# EAGLE schematic PCB_Motor_Robot (EAGLE 7.5.0)
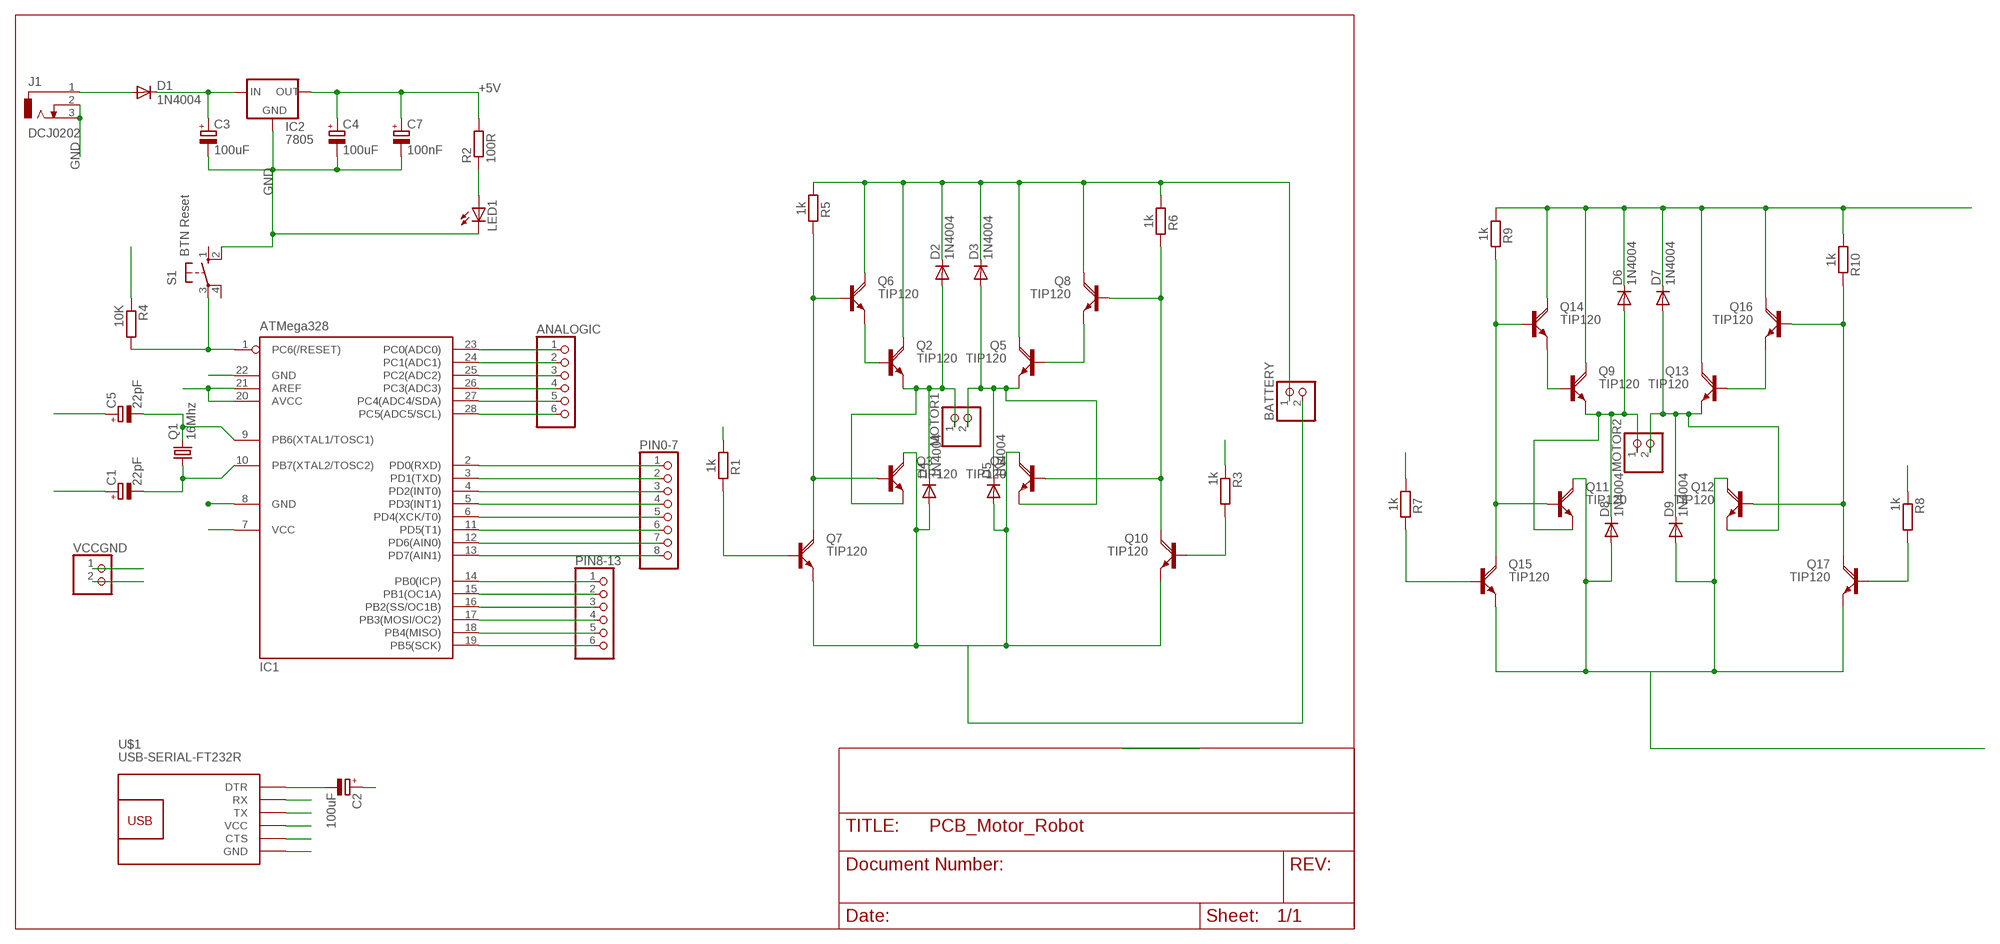
[diagram p0: schematic, sheet 1]

## Parts
ANALOGIC  PINHD-1X6  [1X06]
BATTERY  PINHD-1X2  [1X02]
C1  22pF  CPOL-EUE2.5-5  [E2,5-5]
C2  100uF  CPOL-EUTAP5-50  [TAP5-50]
C3  100uF  CPOL-EUTAP5-50  [TAP5-50]
C4  100uF  CPOL-EUTAP5-50  [TAP5-50]
C5  22pF  CPOL-EUE2.5-5  [E2,5-5]
C7  100nF  CPOL-EUE2.5-5  [E2,5-5]
D1  1N4004  [DO41-10]
D2  1N4004  [DO41-10]
D3  1N4004  [DO41-10]
D4  1N4004  [DO41-10]
D5  1N4004  [DO41-10]
D6  1N4004  [DO41-10]
D7  1N4004  [DO41-10]
D8  1N4004  [DO41-10]
D9  1N4004  [DO41-10]
IC1  ATMega328  MEGA8-P  [DIL28-3]
IC2  7805  78XXL  [78XXL]
J1  DCJ0202  [DCJ0202]
LED1  LED5MM  [LED5MM]
MOTOR1  PINHD-1X2  [1X02]
MOTOR2  PINHD-1X2  [1X02]
PIN0-7  PINHD-1X8  [1X08]
PIN8-13  PINHD-1X6  [1X06]
Q1  16Mhz  CRYSTALHC49S  [HC49/S]
Q2  TIP120  [TO220AH]
Q3  TIP120  [TO220AH]
Q4  TIP120  [TO220AH]
Q5  TIP120  [TO220AH]
Q6  TIP120  [TO220AH]
Q7  TIP120  [TO220AH]
Q8  TIP120  [TO220AH]
Q9  TIP120  [TO220AH]
Q10  TIP120  [TO220AH]
Q11  TIP120  [TO220AH]
Q12  TIP120  [TO220AH]
Q13  TIP120  [TO220AH]
Q14  TIP120  [TO220AH]
Q15  TIP120  [TO220AH]
Q16  TIP120  [TO220AH]
Q17  TIP120  [TO220AH]
R1  1k  R-EU_0204/7  [0204/7]
R2  100R  R-EU_0204/7  [0204/7]
R3  1k  R-EU_0204/7  [0204/7]
R4  10K  R-EU_0204/7  [0204/7]
R5  1k  R-EU_0204/7  [0204/7]
R6  1k  R-EU_0204/7  [0204/7]
R7  1k  R-EU_0204/7  [0204/7]
R8  1k  R-EU_0204/7  [0204/7]
R9  1k  R-EU_0204/7  [0204/7]
R10  1k  R-EU_0204/7  [0204/7]
S1  BTN Reset  10-XX  [B3F-10XX]
U$1  USB-SERIAL-FT232R  [USB-SERIAL-FT232R]
VCCGND  PINHD-1X2  [1X02]

## Nets
+5V: C4.+ C7.+ IC1.7(VCC) IC1.20(AVCC) IC1.21(AREF) IC2.OUT R2.2 R4.1 U$1.4(VCC) VCCGND.1
DTR: C2.- U$1.1(DTR)
GND: BATTERY.2 C1.+ C3.- C4.- C5.+ C7.- D4.A D5.A D8.A D9.A IC1.8(GND) IC1.22(GND) IC2.GND J1.2 J1.3 LED1.K(C) Q3.C Q4.C Q7.E Q10.E Q11.C Q12.C Q15.E Q17.E S1.2(S1) U$1.6(GND) VCCGND.2
M1-A1: IC1.17(PB3(MOSI/OC2)) PIN8-13.4 R3.1
M1-B1: IC1.16(PB2(SS/OC1B)) PIN8-13.3 R1.1
M2-A1: IC1.12(PD6(AIN0)) PIN0-7.7 R8.1
M2-B1: IC1.11(PD5(T1)) PIN0-7.6 R7.1
N$1: C5.- IC1.9(PB6(XTAL1/TOSC1)) Q1.2
N$2: C1.- IC1.10(PB7(XTAL2/TOSC2)) Q1.1
N$3: Q5.B Q8.E
N$4: Q10.B R3.2
N$5: D1.A J1.1
N$6: C3.+ D1.C IC2.IN
N$7: Q7.B R1.2
N$8: Q2.B Q6.E
N$9: Q9.B Q14.E
N$10: Q3.B Q6.B Q7.C R5.2
N$11: Q4.B Q8.B Q10.C R6.2
N$12: Q13.B Q16.E
N$14: D2.A D4.C MOTOR1.1 Q2.E Q3.E
N$15: D3.A D5.C MOTOR1.2 Q4.E Q5.E
N$17: Q17.B R8.2
N$19: Q15.B R7.2
N$20: ANALOGIC.1 IC1.23(PC0(ADC0))
N$21: ANALOGIC.2 IC1.24(PC1(ADC1))
N$22: ANALOGIC.3 IC1.25(PC2(ADC2))
N$23: ANALOGIC.4 IC1.26(PC3(ADC3))
N$24: ANALOGIC.5 IC1.27(PC4(ADC4/SDA))
N$25: ANALOGIC.6 IC1.28(PC5(ADC5/SCL))
N$28: IC1.4(PD2(INT0)) PIN0-7.3
N$29: IC1.5(PD3(INT1)) PIN0-7.4
N$30: IC1.6(PD4(XCK/T0)) PIN0-7.5
N$31: IC1.13(PD7(AIN1)) PIN0-7.8
N$32: IC1.14(PB0(ICP)) PIN8-13.1
N$33: IC1.15(PB1(OC1A)) PIN8-13.2
N$34: IC1.18(PB4(MISO)) PIN8-13.5
N$35: IC1.19(PB5(SCK)) PIN8-13.6
N$36: Q11.B Q14.B Q15.C R9.2
N$37: Q12.B Q16.B Q17.C R10.2
N$40: U$1.5(CTS)
N$41: D6.A D8.C MOTOR2.1 Q9.E Q11.E
N$42: D7.A D9.C MOTOR2.2 Q12.E Q13.E
N$48: LED1.A R2.1
RESET: C2.+ IC1.1(PC6(/RESET)) R4.2 S1.3(P)
RX: IC1.2(PD0(RXD)) PIN0-7.1 U$1.3(TX)
TX: IC1.3(PD1(TXD)) PIN0-7.2 U$1.2(RX)
VCC-BAT: BATTERY.1 D2.C D3.C D6.C D7.C Q2.C Q5.C Q6.C Q8.C Q9.C Q13.C Q14.C Q16.C R5.1 R6.1 R9.1 R10.1
Unconnected: S1.1(S) S1.4(P1)

## Library data of the parts
ANALOGIC PIN8-13 = pinhead:PINHD-1X6: PIN HEADER
BATTERY MOTOR1 MOTOR2 VCCGND = pinhead:PINHD-1X2: PIN HEADER
C1-C5 C7 = rcl:CPOL-EU: POLARIZED CAPACITOR, European symbol
D1-D9 = diode:1N4004: DIODE general purpose rectifier, 1 A
IC1 = atmel:MEGA8-P: MICROCONTROLLER 8 Kbytes FLASH, 1 kbytes SRAM, 512 bytes EEPROM, USART, 4-channel 10 bit ADC, 2-channel 8 bit ADC Pin compatible with Atmega48, ATMega88, ATMega168 Source: avr.lbr; OC_FARNELL: unknown; OC_NEWARK: unknown
IC2 = v-reg:78XXL: VOLTAGE REGULATOR
J1 = con-jack:DCJ0202: DC POWER JACK Source: DCJ0202.pdf; OC_FARNELL: unknown; OC_NEWARK: unknown
LED1 = led:LED: LED OSRAM: - CHIPLED LG R971, LG N971, LY N971, LG Q971, LY Q971, LO R971, LY R971 LH N974, LH R974 LS Q976, LO Q976, LY Q976 LO Q996 - Hyper CHIPLED LW Q18S LB Q993, LB Q99A, LB R99A - SideLED LS A670, LO A670, LY A670, LG A670, LP A670 LB A673, LV A673, LT A673, LW A673 LH A674 LY A675 LS A676, LA A676, LO A676, LY A676, LW A676 LS A679, LY A679, LG A679 - Hyper Micro SIDELED® LS Y876, LA Y876, LO Y876, LY Y876 LT Y87S - SmartLED LW L88C, LW L88S LB L89C, LB L89S, LG L890 LS L89K, LO L89K, LY L89K LS L896, LA L896, LO L896, LY L896 - TOPLED LS T670, LO T670, LY T670, LG T670, LP T670 LSG T670, LSP T670, LSY T670, LOP T670, LYG T670 LG T671, LOG T671, LSG T671 LB T673, LV T673, LT T673, LW T673 LH T674 LS T676, LA T676, LO T676, LY T676, LB T676, LH T676, LSB T676, LW T676 LB T67C, LV T67C, LT T67C, LS T67K, LO T67K, LY T67K, LW E67C LS E67B, LA E67B, LO E67B, LY E67B, LB E67C, LV E67C, LT E67C LW T67C LS T679, LY T679, LG T679 LS T770, LO T770, LY T770, LG T770, LP T770 LB T773, LV T773, LT T773, LW T773 LH T774 LS E675, LA E675, LY E675, LS T675 LS T776, LA T776, LO T776, LY T776, LB T776 LHGB T686 LT T68C, LB T68C - Hyper Mini TOPLED® LB M676 - Mini TOPLED Santana® LG M470 LS M47K, LO M47K, LY M47K Source: http://www.osram.convergy.de LUXEON: - LUMILED® LXK2-PW12-R00, LXK2-PW12-S00, LXK2-PW14-U00, LXK2-PW14-V00 LXK2-PM12-R00, LXK2-PM12-S00, LXK2-PM14-U00 LXK2-PE12-Q00, LXK2-PE12-R00, LXK2-PE12-S00, LXK2-PE14-T00, LXK2-PE14-U00 LXK2-PB12-K00, LXK2-PB12-L00, LXK2-PB12-M00, LXK2-PB14-N00, LXK2-PB14-P00, LXK2-PB14-Q00 LXK2-PR12-L00, LXK2-PR12-M00, LXK2-PR14-Q00, LXK2-PR14-R00 LXK2-PD12-Q00, LXK2-PD12-R00, LXK2-PD12-S00 LXK2-PH12-R00, LXK2-PH12-S00 LXK2-PL12-P00, LXK2-PL12-Q00, LXK2-PL12-R00 Source: www.luxeon.com KINGBRIGHT: KA-3528ASYC Source: www.kingbright.com
PIN0-7 = pinhead:PINHD-1X8: PIN HEADER
Q1 = crystal:CRYSTAL: CRYSTAL; OC_FARNELL: 1667008; OC_NEWARK: unknown
Q2-Q17 = transistor-power:TIP120: NPN DARLINGTON TRANSISTOR
R1-R10 = rcl:R-EU_: RESISTOR, European symbol
S1 = switch-omron:10-XX: OMRON SWITCH; MPN: B3F-1000; OC_FARNELL: 176432; OC_NEWARK: 36M3542
U$1 = diy-modules:USB-SERIAL-FT232R: USB to Serial UART Converter based on FT232R chip More information about FT232R chip is available here: http://www.ftdichip.com/Products/ICs/FT232R.htm Click here to find device on ebay.com <http://www.ebay.com/sch/ft232rl+arduino+download+max232>